# EAGLE design og20_rev2 (EAGLE 9.6.2)
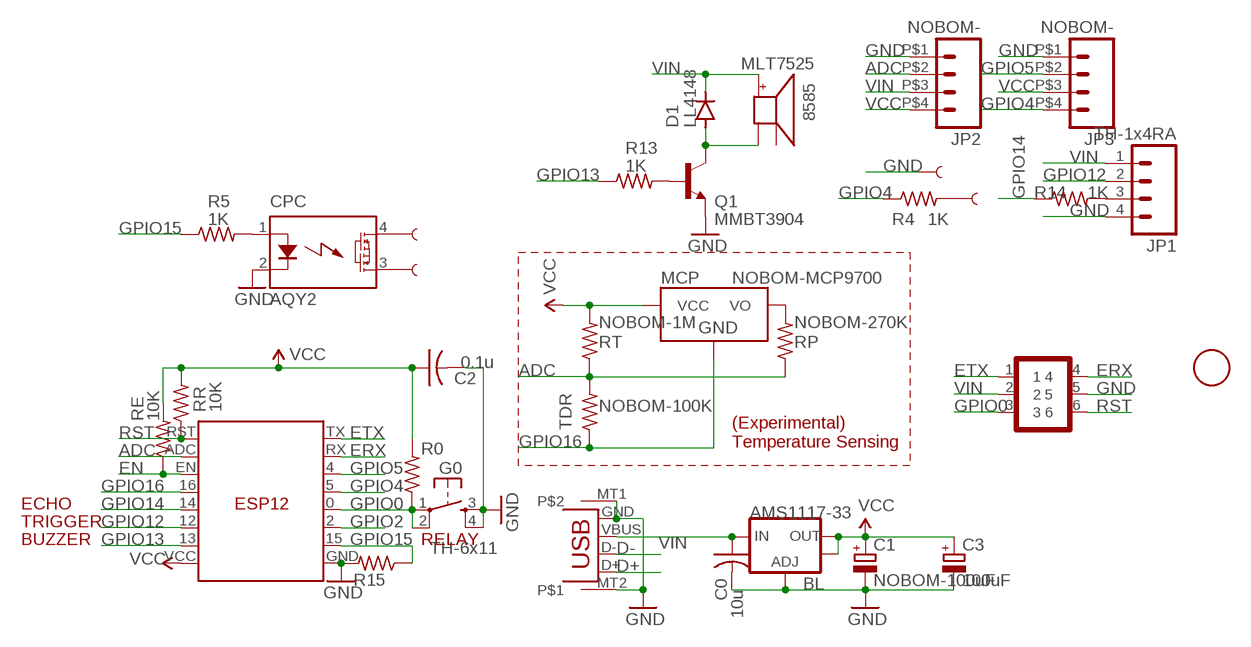
[diagram p0: schematic, sheet 1]

## Parts
0F  FIDUCIAL  [FIDUCIAL_1MM]
8585  MLT7525  BUZZER  [SMT-8585-BUZZER]
BL  AMS1117-33  V_REG_LM1117SOT223  [SOT223]
C0  10u  C-USC0805K  [C0805K]
C1  NOBOM-100uF  CPOL-EUB/3528-21R  [B/3528-21R]
C2  0.1u  C-USC0603K  [C0603K]
C3  100uF  CPOL-EUC  [PANASONIC_C]
CPC  AQY2  AQY282  [PHOTOMOS]
D1  LL4148  DIODE-MINIMELF  [MINIMELF]
ESP  ESP8266  ESP12  [ESP12]
G0  TH-6x11  TAC_SWITCHPTH  [TACTILE-PTH]
JP1  TH-1x4RA  M04EXT2  [1X04_SONICSENSOR_EXT2]
JP2  NOBOM-  M042X2  [1X04-2X2]
JP3  NOBOM-  M042X2  [1X04-2X2]
MCP  NOBOM-MCP9700  MCP9700SMD  [SOT23-3]
Q1  MMBT3904  TRANSISTOR_NPNSOT23-3  [SOT23-3]
R0  10K  R-US_R0603  [R0603]
R4  1K  R-US_R0603  [R0603]
R5  1K  R-US_R0603  [R0603]
R13  1K  R-US_R0603  [R0603]
R14  1K  R-US_R0603  [R0603]
R15  10K  R-US_R0603  [R0603]
RE  10K  R-US_R0603  [R0603]
RP  NOBOM-270K  R-US_R0603  [R0603]
RR  10K  R-US_R0603  [R0603]
RT  NOBOM-1M  R-US_R0603  [R0603]
TDR  NOBOM-100K  R-US_R0805  [R0805]
U$1  NOBOM-GF2x3  GOLDFINGER_2X3  [GOLDFINGER_2X3]
U$2  NOBOM-  SEWTAP3MM-1SIDE  [PETAL-3MM-1SIDE]
U$3  NOBOM-  SEWTAP3MM-1SIDE  [PETAL-3MM-1SIDE]
U$4  NOBOM-  SEWTAP3MM-1SIDE  [PETAL-3MM-1SIDE]
U$5  NOBOM-  SEWTAP3MM-1SIDE  [PETAL-3MM-1SIDE]
X3  MICROXNJ  USB+GND  [USB-MICROB2]

## Nets
ADC: ESP.ADC JP2.P$2 RP.1 RT.1 TDR.2
D+: X3.D+
D-: X3.D-
EN [power]: ESP.EN RE.1
ERX: ESP.RX U$1.4
ETX: ESP.TX U$1.1
GND: BL.1(ADJ) C0.2 C1.- C2.2 C3.- CPC.2(K) ESP.GND G0.3 G0.4 JP1.4 JP2.P$1 JP3.P$1 Q1.2(E) R15.2 U$1.5 U$4.P$1 X3.GND X3.MT1 X3.MT2
GPIO0: ESP.0(G0) G0.1 G0.2 R0.1 U$1.3
GPIO2: ESP.2(G2)
GPIO4: ESP.5(G5) JP3.P$4 R4.1
GPIO5: ESP.4(G4) JP3.P$2
GPIO12: ESP.12(G12) JP1.2
GPIO13: ESP.13(G13) R13.1
GPIO14: ESP.14(G14) R14.1
GPIO15: ESP.15(G15) R5.1 R15.1
GPIO16: ESP.16(G16) MCP.3(GND) TDR.1
N$1 [relaypower]: CPC.4(DS1) U$2.P$1
N$2 [relaypower]: CPC.3(DS2) U$3.P$1
N$3: R4.2 U$5.P$1
N$5: JP1.3 R14.2
N$6 [power]: 8585.- D1.A Q1.3(C)
N$7: MCP.2(VO) RP.2
N$8: Q1.1(B) R13.2
N$9: CPC.1(A) R5.2
RST: ESP.RST RR.1 U$1.6
VCC [power]: BL.2(OUT) BL.4(OUT) C1.+ C2.1 C3.+ ESP.VCC JP2.P$4 JP3.P$3 MCP.1(VCC) R0.2 RE.2 RR.2 RT.2
VIN [power]: 8585.+ BL.3(IN) C0.1 D1.C JP1.1 JP2.P$3 U$1.2 X3.VBUS
Unconnected: 8585.A-

## Notes on the sheet
- (Experimental)
  Temperature Sensing
- ECHO
- TRIGGER
- BUZZER | RELAY

## Library data of the parts
0F = adafruitGood:FIDUCIAL: For use by pick and place machines to calibrate the vision/machine, 1mm By microbuilder.eu
8585 = adafruit:BUZZER
BL = SparkFun:V_REG_LM1117: Voltage Regulator LM1117 Standard adjustable voltage regulator but in SMD form. Spark Fun Electronics SKU : COM-00595
C0 C2 = adafruit:C-US: CAPACITOR, American symbol
C1 C3 = rcl:CPOL-EU: POLARIZED CAPACITOR, European symbol; SPICEPREFIX: C
CPC = adafruit:AQY282
D1 = diode:DIODE-: DIODE
ESP = JeeParts:ESP12
G0 = SparkFun:TAC_SWITCH: Momentary Switch Button commonly used for reset or general input. Spark Fun Electronics SKU : COM-00097
JP1-JP3 = SparkFun:M04: Header 4 Standard 4-pin 0.1" header. Use with straight break away headers (SKU : PRT-00116), right angle break away headers (PRT-00553), swiss pins (PRT-00743), machine pins (PRT-00117), and female headers (PRT-00115). Molex polarized connector foot print use with SKU : PRT-08231 with associated crimp pins and housings.
MCP = SparkFunNew:MCP9700
Q1 = SparkFunNew:TRANSISTOR_NPN: Transistor NPN BJT configuration in SOT23 package. MMBT2222 is the common NPN we use. Double check BCE configuration again layout.
R0 R15 RE RP RR RT = adafruit (picker 的冲突副本 2014-10-29):R-US_: RESISTOR, American symbol
R4 R5 R13 R14 = adafruit2013:R-US_: RESISTOR, American symbol
TDR = adafruit:R-US_: RESISTOR, American symbol
U$1 = SparkFunNew:GOLDFINGER_2X3
U$2-U$5 = LilyPad-Wearables:SEWTAP
X3 = SparkFunNew:USB+GND

## Net classes
0 default: width 0.254 mm, clearance 0.203 mm
1 power: width 0.305 mm, clearance 0.203 mm
2 relaypower: width 0.406 mm, clearance 0.305 mm

## Board
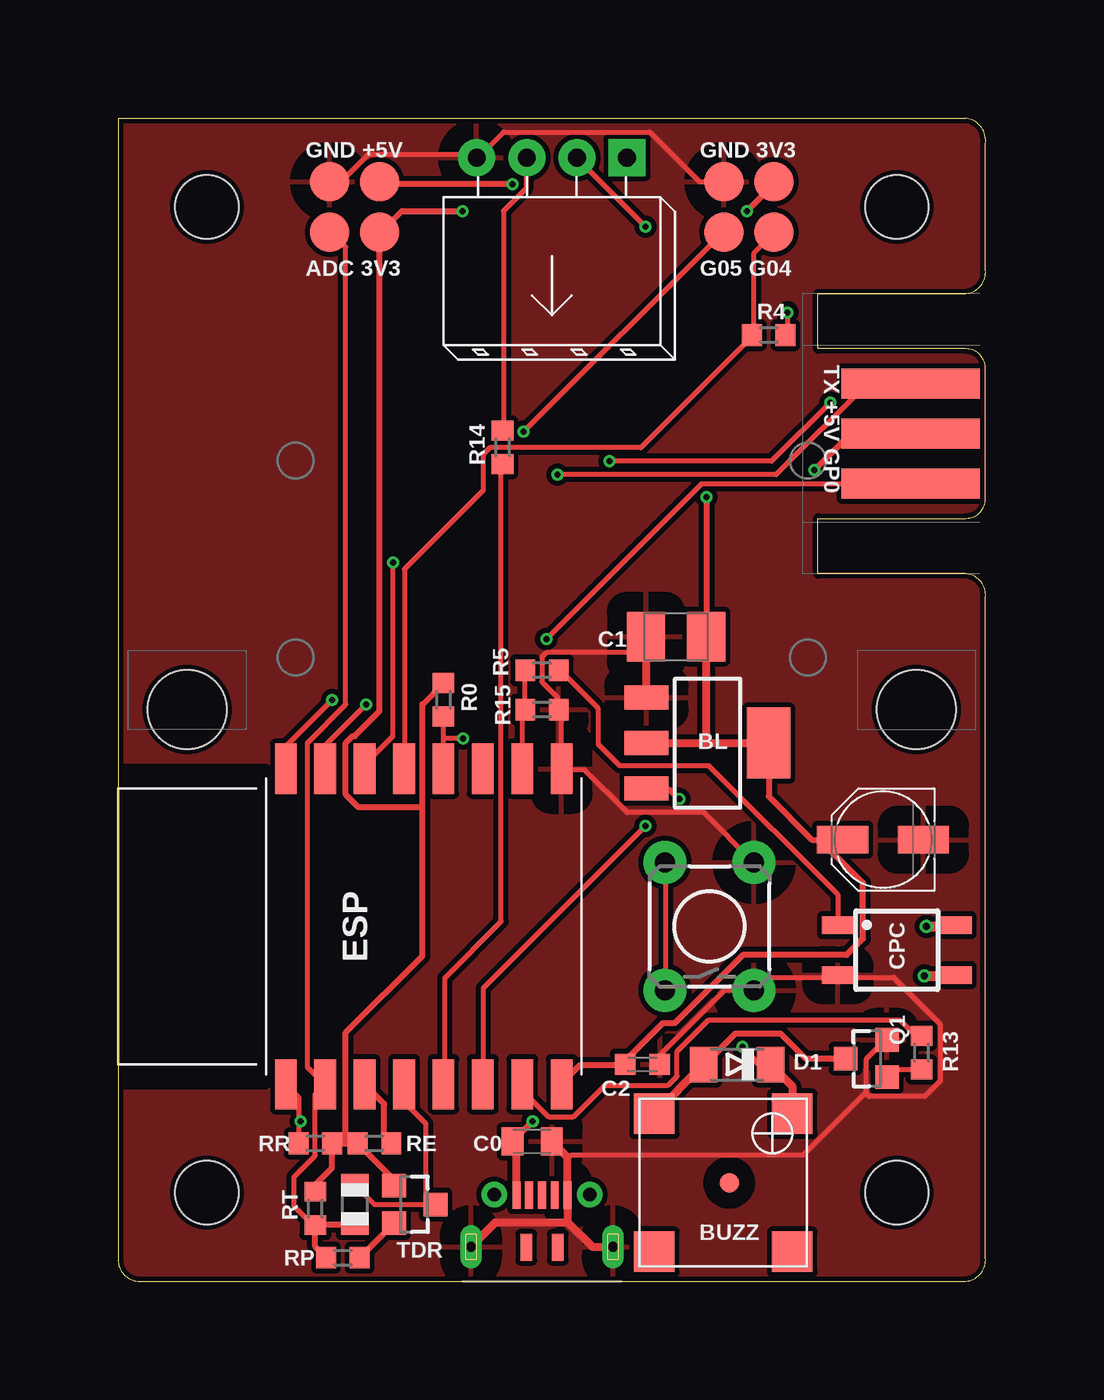
[diagram p1: board, top side]
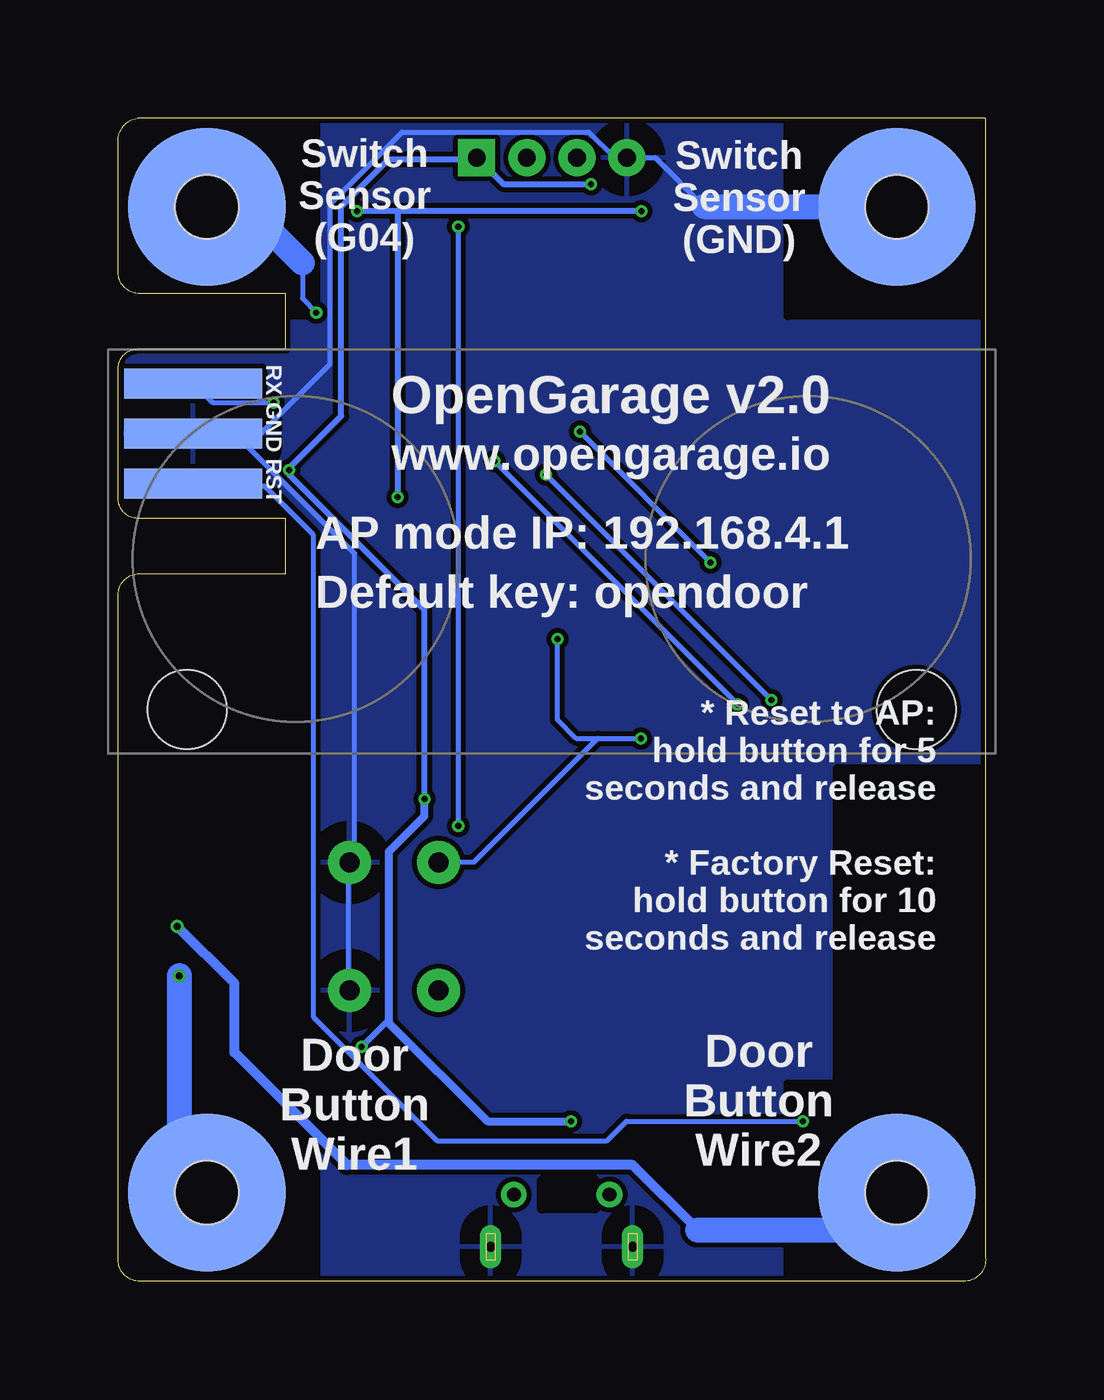
[diagram p2: board, bottom side, seen from below]

Size 44.01 x 59 mm. Coordinates in mm from the lower left corner, seen from the top.
Outline: 1,0 43,0 arc90 44,1.2 44,34.7 arc90 43,35.9 35.5,35.9 35.5,38.7 43,38.7 arc90 44,39.7 44,46.3 arc90 43,47.3 35.5,47.3 35.5,50.1 43,50.1 arc90 44,51.3 44,57.7 arc90 43,59 0,59 0,1.2 arc90 1,0
Copper layers (1*16): Top 0.035mm / dielectric 1.5mm / Bottom 0.035mm
Design rules "Fusion_eagle_rule_v1.1 *": minimum track width 6mil, minimum drill 12mil, track to track 6mil, track to pad 6mil, pad to pad 6mil, via to via 6mil, smd to smd 0mil, copper to edge 10mil, drill to drill 10mil, minimum pad ring 10mil, minimum via ring 6mil, stop-mask expansion 2mil, vias tented up to drill 100mil, thermal gap 40mil
Holes 4 mm at 3.5,29 40.5,29
Holes 3.2 mm at 4.5,4.5 39.5,4.5 39.5,54.5 4.5,54.5
tRestrict: area 0,10 to 7.5,26
bRestrict: area 0,0 to 10,10; area 34,0 to 44,10; area 34,49 to 44,59; area 0,49 to 10,59; area 19.8,3.7 to 22.5,5.1; area 0,10 to 7.5,26
vRestrict: area 7,11 to 24,25

### Footprints (pad centres in the part's own frame; a part is rotated, then mirrored left to right if it is on the bottom)
FIDUCIAL_1MM = smd 1 x 1: 1 0,0
SMT-8585-BUZZER = smd 2.05 x 2.05: + -3.5,3.5; - -3.5,-3.5; A- 3.5,-3.5; NC1 3.5,3.5
SOT223 = smd 2.235 x 1.219: 1 3.099,-2.311; 2 3.099,0; 3 3.099,2.311 | smd 2.2 x 3.6: 4 -3.099,0
C0805K = smd 1.1 x 1.4: 1 -1,0; 2 1,0
B/3528-21R = smd 1.95 x 2.5: + 1.525,0; - -1.525,0
C0603K = smd 1.05 x 1.08: 1 -0.875,0; 2 0.875,0
PANASONIC_C = smd 2.6 x 1.4: + 2.05,0; - -2.05,0
PHOTOMOS = smd 0.9 x 1.6: 1 1.27,3; 2 -1.27,3; 3 -1.27,-3; 4 1.27,-3
MINIMELF = smd 1.4 x 1.8: A 1.7,0; C -1.7,0
ESP12 = smd 1.1 x 2.54: 0 4.5,8; 2 6.5,8; 4 0.5,8; 5 2.5,8; 12 6.5,-8; 13 8.5,-8; 14 4.5,-8; 15 8.5,8; 16 2.5,-8; ADC -1.5,-8; EN 0.5,-8; GND 10.5,8; RST -3.5,-8; RX -1.5,8; TX -3.5,8; VCC 10.5,-8
TACTILE-PTH = drill 1.016 pad 2.184: 1 -3.251,2.261; 2 3.251,2.261; 3 -3.251,-2.261; 4 3.251,-2.261
1X04_SONICSENSOR_EXT2 = drill 0.9 pad 1.88 square: 1 -3.81,0 | drill 0.9 pad 1.88: 2 -1.27,0; 3 1.27,0; 4 3.81,0
1X04-2X2 = smd 2 x 2: P$1 -1.27,1.27; P$2 -1.27,-1.27; P$3 1.27,1.27; P$4 1.27,-1.27
SOT23-3 = smd 1.2 x 1.2: 1 1,-0.95; 2 1,0.95; 3 -1.1,0
R0603 = smd 1 x 1.1: 1 -0.85,0; 2 0.85,0
R0805 = smd 1.1 x 1.4: 1 -1,0; 2 1,0
GOLDFINGER_2X3 = smd 1.524 x 7: 1 -2.54,-3.5; 2 0,-3.5; 3 2.54,-3.5 | smd 1.524 x 7 bottom: 4 -2.54,-3.5; 5 0,-3.5; 6 2.54,-3.5
PETAL-3MM-1SIDE = smd 8 x 8: P$1 0,0
USB-MICROB2 = smd 1.4 x 0.4: D+ -1.375,0; D- -1.375,-0.65; GND -1.375,1.3; ID -1.375,0.65; VBUS -1.375,-1.3 | drill 0.5 pad 1.1 long: MT1 1.25,-3.6; MT2 1.25,3.6 | smd 1.35 x 0.6: MT3 1.275,0.8; MT4 1.275,-0.8 | drill 0.7 pad 1.3: MT5 -1.4,-2.425; MT6 -1.4,2.425

### Placement (x,y rotation side)
0F  31,5 0 top
8585  30.7,5 270 top
BL  29.9,27.3 180 top
C0  21,7.1 0 top
C1  28.3,32.7 0 top
C2  26.6,11 0 top
C3  38.8,22.4 180 top
CPC  39.5,16.8 90 top
D1  31.4,11 180 top
ESP  12,18 0 top
G0  30,18 90 top
JP1  22,57 180 top
JP2  12,54.5 0 top
JP3  32,54.5 0 top
MCP  15,3.9 180 top
Q1  38,11.3 0 top
R0  16.5,29.5 90 top
R4  33,48 0 top
R5  21.5,31 0 top
R13  40.75,11.6 270 top
R14  19.5,42.3 90 top
R15  21.5,29 0 top
RE  13,7 180 top
RP  11.4,1.2 0 top
RR  10,7 0 top
RT  10,3.7 90 top
TDR  12,3.9 270 top
U$1  43.7,43 270 top
U$2  4.5,4.5 0 bottom
U$3  39.5,4.5 0 bottom
U$4  4.5,54.5 0 bottom
U$5  39.5,54.5 0 bottom
X3  21.5,3 270 top

### Tracks (layer width: path | path; a pad name or v marks a point on that pad's centre or on a via)
ADC
  Top 0.254: RT.1 9.89,2.85 8.92,3.81 8.92,5.29 10,6.37 10,9.5 ESP.ADC 10.41,10.06 9.61,10.86 9.61,27.32 11.55,29.26 11.55,52.46 10.78,53.23 JP2.P$2
  Top 0.305: TDR.2 10.05,2.9 RT.1 10,1.75 RP.1
EN
  Top 0.305: RE.1 13.5,7.35 13.5,9 ESP.EN
ERX  (via drill 0.3)
  Top 0.254: v12.58,29.26 10.52,27.2 10.52,26.06 ESP.RX | v24.92,41.6 33.15,41.6 v36.12,44.58
  Bottom 0.254: v24.92,41.6 v12.58,29.26 | v36.12,44.58 39.21,44.58 40.12,45.49 U$1.4
ETX  (via drill 0.3)
  Top 0.254: v10.86,29.49 8.58,27.2 8.58,26.06 ESP.TX | v22.29,40.92 33.38,40.92 37.95,45.49 40.12,45.49 U$1.1
  Bottom 0.254: v22.29,40.92 v10.86,29.49
GND
  Top 0.254: JP2.P$1 10.75,55.78 11.32,55.78 12.69,57.15 18.06,57.15 18.18,57.04 JP1.4 18.29,57.04 19.55,58.29 26.98,58.29 29.49,55.78 30.64,55.78 JP3.P$1 | C2.2 27.55,11.09 27.55,11.54 30.75,14.74 32.24,14.74 G0.3 32.35,14.86 32.91,15.42 36.47,15.42 CPC.2 36.58,15.42 39.34,15.42 41.72,13.03 41.72,10.17 40.92,9.37 38.09,9.37 37.91,9.56 | Q1.2 38.93,12.25 37.97,11.29 37.97,9.6 37.95,9.6 37.91,9.56 | 37.91,9.56 34.75,6.4 22.98,6.4 22.8,6.3 | C1.- 26.64,31.89 21.72,31.89 21.49,31.66 21.49,30.4 22.29,29.6 22.29,29.03 R15.2 22.5,28.85 ESP.GND 22.52,25.95 23.66,25.95 25.84,23.77 29.72,23.77 32.24,21.26 G0.4
  Top 0.406: C1.- 26.78,29.64 BL.1 | C0.2 22.8,6.3 X3.GND 22.8,3 | 22.8,3 24.05,1.75 X3.MT2 | X3.MT1 19.15,3 22.8,3
  Bottom 0.254: 14.28,54.52 16.76,57 JP1.4 18.29,57.04 18.86,57.04 20.12,58.29 29.61,58.29 33.27,54.63 33.27,46.52 37.38,42.41 U$1.5 40.12,42.98 38.07,42.98 32.01,36.92 32.01,21.49 32.24,21.26 G0.4 32.35,21.14 32.35,14.86 G0.3 | 4.58,54.52 U$4.P$1
  Bottom 1.27: 14.28,54.52 4.58,54.52
  pour Top (isolate 0.254): 0,59 44,59 44,0 0,0
  pour Bottom (isolate 0.254): 0,59 44,59 44,0 0,0
GPIO0  (via drill 0.3)
  Top 0.254: ESP.0 16.5,27.55 | 16.5,27.55 R0.1 | v17.49,27.55 16.5,27.55 | G0.1 27.78,14.86 27.78,21.14 G0.2 | v21.72,32.58 29.61,40.46 40.12,40.46 U$1.3
  Bottom 0.254: 19.68,27.55 20.78,27.55 21.72,28.49 v21.72,32.58 | 19.68,27.55 v17.49,27.55 | 19.68,27.55 25.97,21.25 G0.2
GPIO4
  Top 0.254: JP3.P$4 33.27,53.15 32.24,52.12 32.24,48.01 R4.1 32.12,47.89 26.52,42.29 18.86,42.29 18.52,41.95 18.52,40.12 14.52,36.12 14.52,26.06 ESP.5
GPIO5  (via drill 0.3)
  Top 0.254: v20.58,43.09 30.64,53.15 JP3.P$2 | v13.95,36.46 13.95,27.66 12.58,26.29 12.58,26.06 ESP.4
  Bottom 0.254: v13.95,36.46 v20.58,43.09
GPIO12  (via drill 0.3)
  Top 0.254: v26.75,23.09 18.52,14.86 18.52,10.06 ESP.12 | v26.75,53.49 23.32,56.92 JP1.2
  Bottom 0.254: v26.75,53.49 v26.75,23.09
GPIO13
  Top 0.254: R13.1 40.7,12.46 40.47,12.46 39.67,13.26 29.95,13.26 28.35,11.66 28.35,10.4 27.89,9.94 24.69,9.94 23.09,8.34 21.84,8.34 20.58,9.6 20.58,9.94 ESP.13
GPIO14
  Top 0.254: R14.1 19.44,41.38 19.44,18.26 16.58,15.4 16.58,10.06 ESP.14
GPIO15
  Top 0.254: ESP.15 20.5,28.85 R15.1 R5.1
GPIO16
  Top 0.254: TDR.1 13,3.9 15.6,3.9 | 15.6,3.9 MCP.3 | ESP.16 14.5,9.1 15.6,8 15.6,3.9
N$1  (via drill 0.35)
  Top 0.508: v41,18 42.43,18 CPC.4
  Bottom 0.508: v41,18 38.1,15.1 38.1,11.6 32.4,5.9 17.9,5.9 14.6,2.6
  Bottom 1.27: 14.6,2.6 6.4,2.6 U$2.P$1
N$2  (via drill 0.35)
  Top 0.508: v40.9,15.5 42.47,15.5 CPC.3
  Bottom 0.508: U$3.P$1 40.9,5.9
  Bottom 1.27: v40.9,15.5 40.9,5.9
N$3  (via drill 0.3)
  Top 0.254: v33.95,49.15 33.95,48.01 R4.2
  Bottom 0.254: 34.65,51.65 34.65,49.85 v33.95,49.15 | 37.41,54.41 39.44,54.41 U$5.P$1
  Bottom 1.27: 37.41,54.41 34.65,51.65
N$5
  Top 0.254: R14.2 19.55,43.2 19.55,54.29 20.69,55.44 20.69,56.92 JP1.3
N$6
  Top 0.305: Q1.3 36.81,11.32 34.87,11.32 33.61,12.57 31.32,12.57 29.84,11.09 D1.A
  Top 0.406: 8585.- D1.A
N$7
  Top 0.305: RP.2 MCP.2
N$8
  Top 0.254: Q1.1 39.4,10.75 R13.2
N$9
  Top 0.254: R5.2 22.41,31 24.36,29.05 24.36,27.23 25.45,26.15 29.98,26.15 36.5,19.62 CPC.1
RST  (via drill 0.3)
  Top 0.254: ESP.RST 9.15,9.35 9.15,8.12 | 9.15,8.12 RR.1 | v9.26,8.12 9.15,8.12
  Bottom 0.254: v9.26,8.12 18.22,8.12 19.21,7.13 27.82,7.13 34.11,13.42 34.11,37.88 36.58,40.35 40.12,40.35 U$1.6
VCC  (via drill 0.3)
  Top 0.305: 11.55,7 RR.2 10.85,5.75 10,4.9 RT.2 | 11.55,7 RE.2 14,5.15 MCP.1 | ESP.VCC 22.52,10.06 23.44,10.97 25.72,10.97 C2.1 25.73,11.2 27.63,13.1 28.24,13.1 31.69,16.55 36.95,16.55 37.79,17.39 37.79,20.21 35.6,22.4 | 15.44,24.05 15.44,16.5 11.55,12.62 11.55,7 | 15.44,24.05 15.44,29.26 16.46,30.29 R0.2 | 15.44,24.05 12.19,24.05 11.55,24.69 11.55,27.32 11.89,27.66 12.01,27.66 13.26,28.92 13.26,53.15 JP2.P$4 13.38,53.26 14.41,54.29 v17.46,54.29 | v31.89,54.29 33.27,55.66 JP3.P$3 | v29.84,39.78 29.84,32.8 C1.+ | BL.4 33,24.6 35.2,22.4 35.6,22.4 | 35.6,22.4 C3.+
  Top 0.406: BL.2 29.8,27.3 | 29.8,27.3 BL.4 | C1.+ 29.83,27.32 29.8,27.3
  Bottom 0.305: v17.46,54.29 29.84,54.29 | 29.84,54.29 v31.89,54.29 | 29.84,54.29 v29.84,39.78
VIN  (via drill 0.3)
  Top 0.305: v20.01,55.66 13.38,55.66 JP2.P$3 | v28.47,24.46 28.01,24.92 26.86,24.92 BL.3 | v31.67,11.89 31.67,11.84 32.51,11 D1.C | v21.04,8.12 20.12,7.2 C0.1 | v35.32,41.15 37.15,42.98 40.12,42.98 U$1.2
  Top 0.406: X3.VBUS 20.2,6.9 C0.1 | D1.C 34.2,9.9 8585.+
  Bottom 0.305: v20.01,55.66 24.46,55.66 25.72,56.92 JP1.1 25.95,56.92 30.29,56.92 32.69,54.52 32.69,43.89 35.32,41.26 v35.32,41.15 35.32,40.92 28.47,34.06 v28.47,24.46 | v31.67,11.89 30.27,13.29 | 30.25,13.09 30.27,13.09
  Bottom 0.406: v28.47,24.46 28.47,23.6 30.27,21.8 30.27,13.29 30.27,13.09 | v21.04,8.12 25.28,8.12 30.25,13.09

### Text on the board
tNames: GND +5V | GND 3V3 | ADC 3V3 | G05 G04 | TX +5V GP0 | BUZZ
bNames: Switch / Sensor / (GND) | Switch / Sensor / (G04) | RX GND RST | OpenGarage v2.0 | www.opengarage.io | AP mode IP: 192.168.4.1 | Default key: opendoor | * Reset to AP: / hold button for 5 / seconds and release / / * Factory Reset: / hold button for 10 / seconds and release | Door / Button / Wire2 | Door / Button / Wire1